# Altium project RFSOC_SAWG.PrjPCB (part 1 of 10)
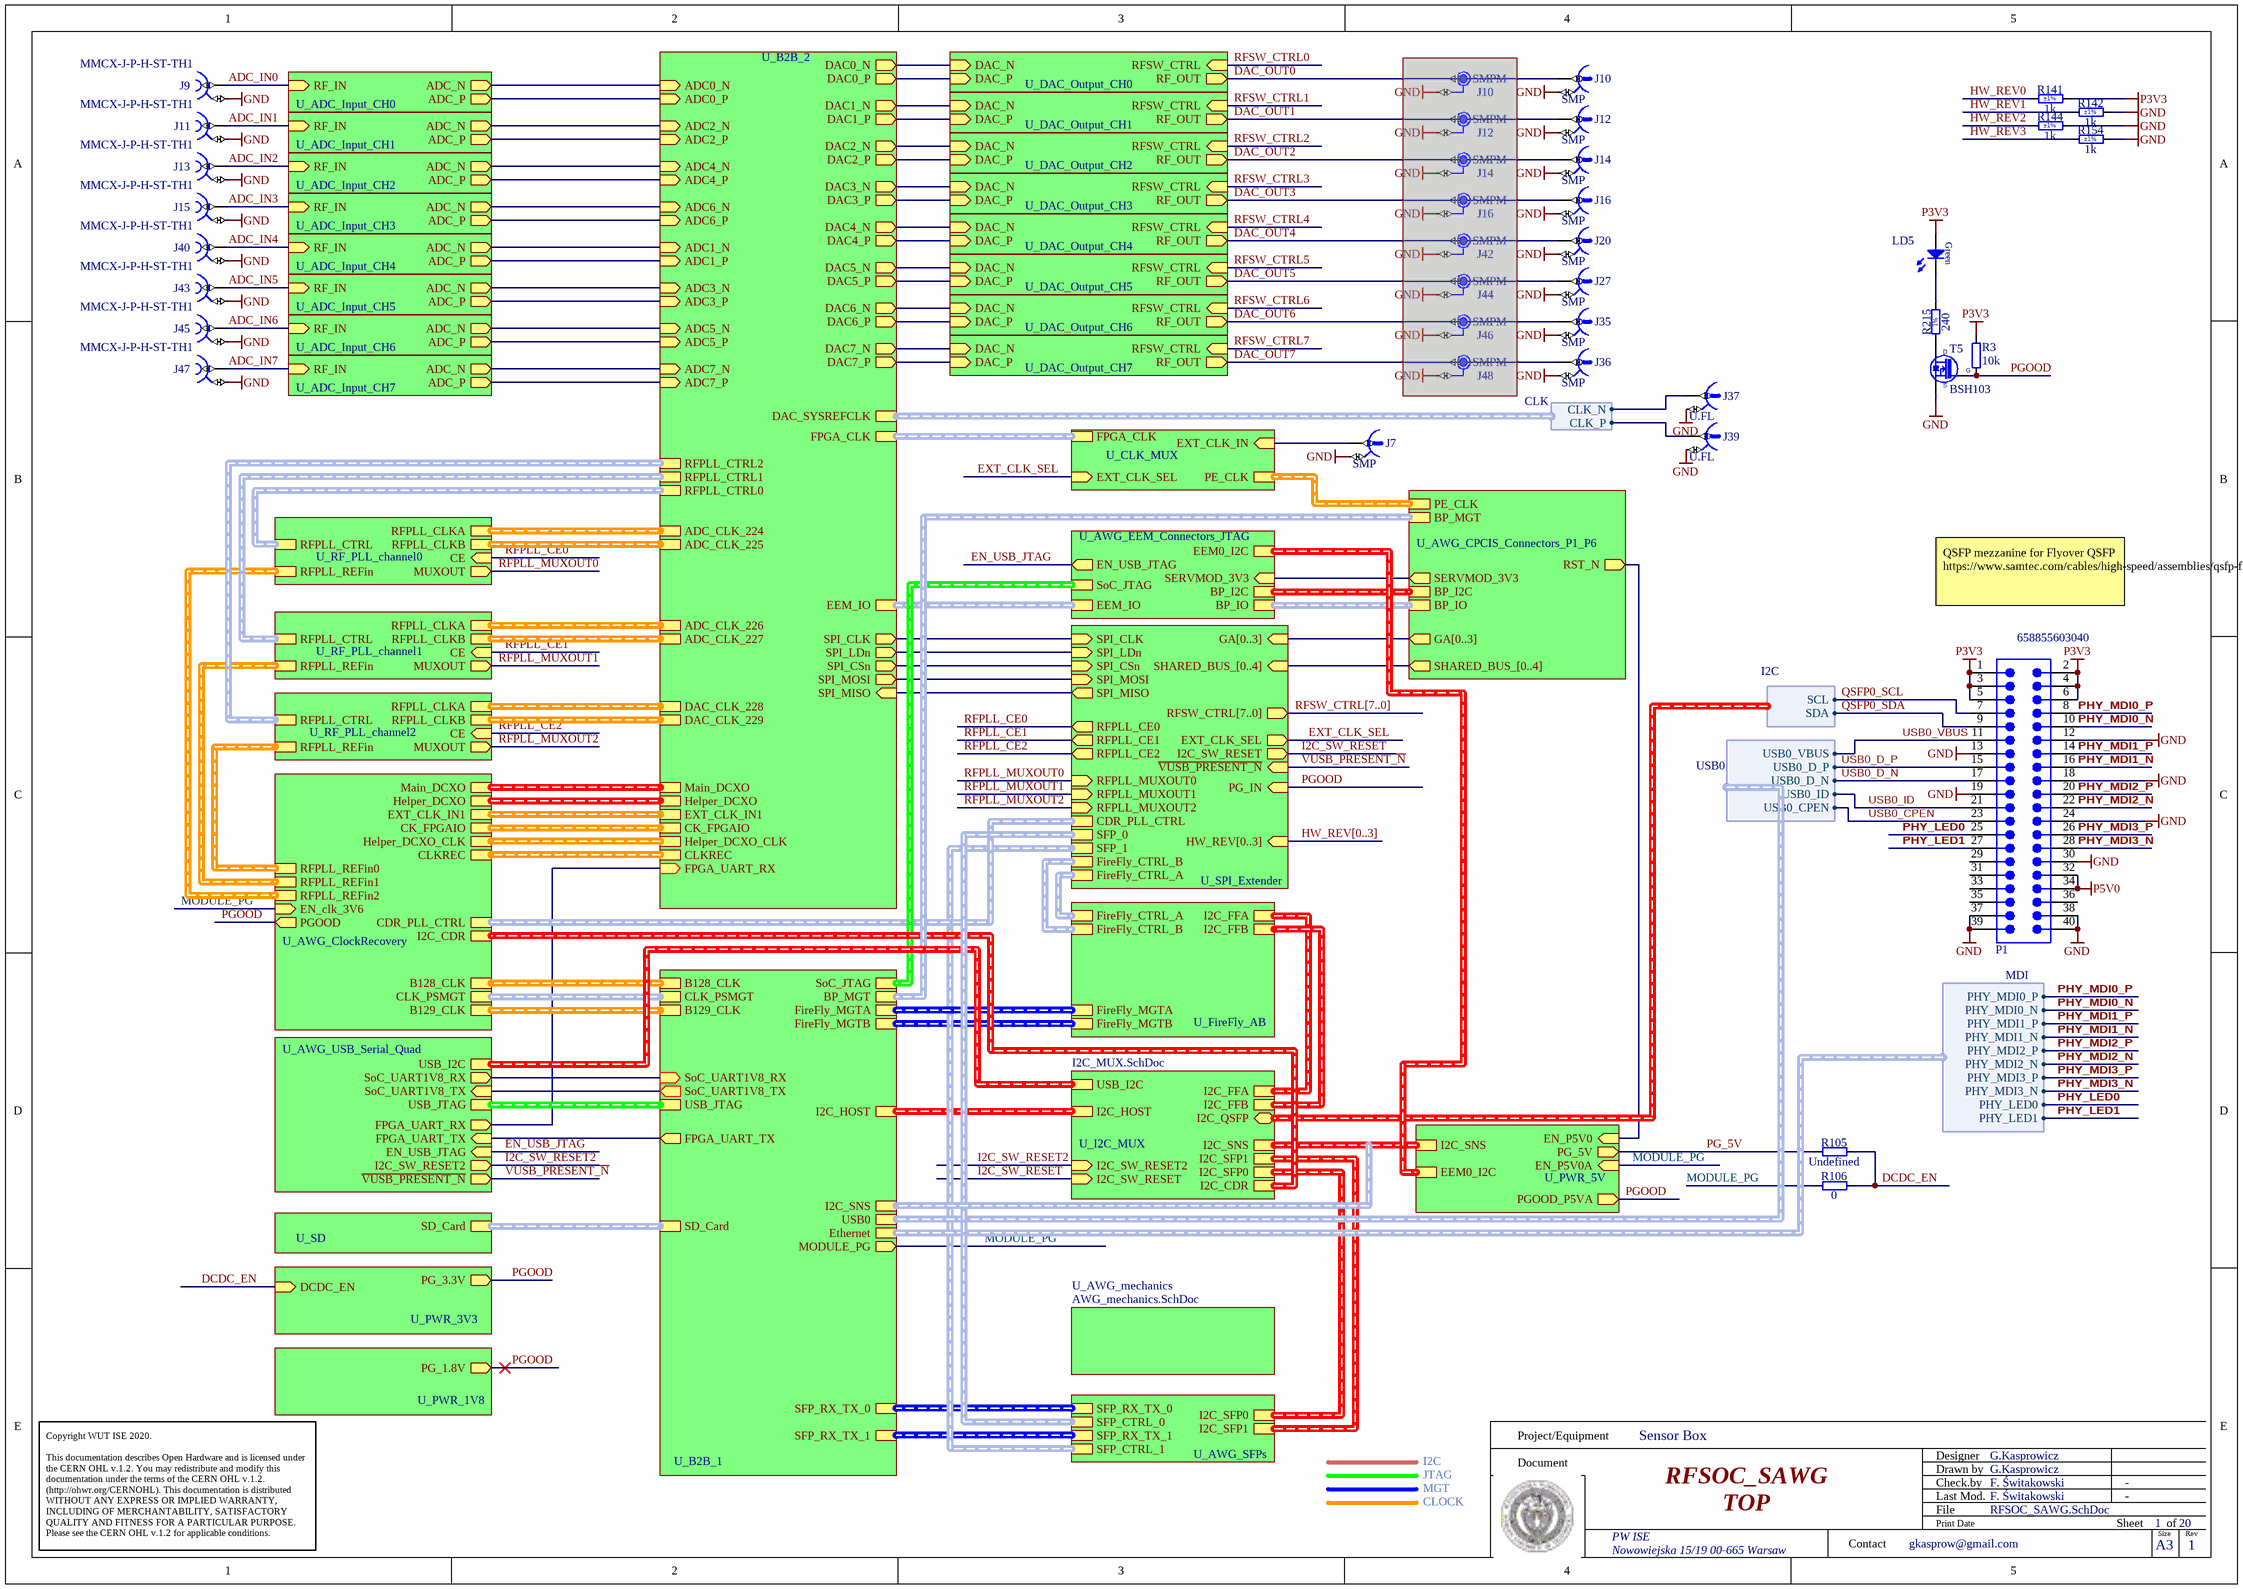
[diagram p0: RFSOC_SAWG.SchDoc]
Version: 2.0.1
20 sheets, 1119 parts. Net scope: hierarchical (ports join the sheet entries above them; power ports are global).
Board file: RFSOC_SAWG.PcbDoc
Sheets:
  RFSOC_SAWG.SchDoc
    U_CLK_MUX = AWG_CLK_Connectors.SchDoc
    U_FireFly_AB = FireFly_AB.SchDoc
    U_I2C_MUX = I2C_MUX.SchDoc
    U_SD = SD.SchDoc
    U_B2B_1 = B2B_1.SchDoc
    U_B2B_2 = B2B_2.SchDoc
    U_PWR_3V3 = PWR_3V3.SchDoc
    U_PWR_1V8 = PWR_1V8.SchDoc
    U_PWR_5V = PWR_5V.SchDoc
    U_AWG_CPCIS_Connectors_P1_P6 = AWG_CPCIS_Connectors_P1_P6.SchDoc
    U_AWG_EEM_Connectors_JTAG = AWG_EEM_Connectors_JTAG.SchDoc
    U_DAC_Output_CH0 = DAC_Output_CH.SchDoc
    U_DAC_Output_CH1 = DAC_Output_CH.SchDoc
    U_DAC_Output_CH2 = DAC_Output_CH.SchDoc
    U_DAC_Output_CH3 = DAC_Output_CH.SchDoc
    U_DAC_Output_CH4 = DAC_Output_CH.SchDoc
    U_DAC_Output_CH5 = DAC_Output_CH.SchDoc
    U_DAC_Output_CH6 = DAC_Output_CH.SchDoc
    U_DAC_Output_CH7 = DAC_Output_CH.SchDoc
    U_ADC_Input_CH0 = ADC_Input_CH.SchDoc
    U_ADC_Input_CH1 = ADC_Input_CH.SchDoc
    U_ADC_Input_CH2 = ADC_Input_CH.SchDoc
    U_ADC_Input_CH3 = ADC_Input_CH.SchDoc
    U_ADC_Input_CH4 = ADC_Input_CH.SchDoc
    U_ADC_Input_CH5 = ADC_Input_CH.SchDoc
    U_ADC_Input_CH6 = ADC_Input_CH.SchDoc
    U_ADC_Input_CH7 = ADC_Input_CH.SchDoc
    U_AWG_SFPs = AWG_SFPs.SchDoc
    U_AWG_ClockRecovery = AWG_ClockRecovery.SchDoc
    U_RF_PLL_channel2 = RF_PLL_channel.SchDoc
    U_RF_PLL_channel0 = RF_PLL_channel.SchDoc
    U_RF_PLL_channel1 = RF_PLL_channel.SchDoc
    U_SPI_Extender = SPI_Extender.SchDoc
    U_AWG_mechanics = AWG_mechanics.SchDoc
    U_AWG_USB_Serial_Quad = AWG_USB_Serial_Quad.SchDoc

## Sheet RFSOC_SAWG.SchDoc: RFSOC_SAWG
size 420 x 297 mm; CheckedBy: F. Świtakowski; Author: G.Kasprowicz; CompanyName: WUT ISE; DrawnBy: G.Kasprowicz; Organization: WUT ISE; Address1: PW ISE; Address2: Nowowiejska 15/19 00-665 Warsaw; Address3: gkasprow@gmail.com; DocumentNumber: 1; Revision: 1; SheetNumber: 1; SheetTotal: 20; ModifiedBy: F. Świtakowski; CheckedDate: -; Title2: TOP; DivGrp: WUT ISE; Designer: G.Kasprowicz; ModifiedDate: -; ProjectName: Sensor Box

### Parts
(Parts that share a designator on the sheet are numbered #1, #2 ... from top to bottom, then left to right.)
J7  SMP  [AMPHENOL_302102]
J9  Manufacturer Part Number: MMCX-J-P-H-ST-TH1  [SAMTEC_MMCX-J-P-H-ST-TH1]  (hidden comment: Coax_1Female_1Shield)
J10#1  SMPM  [SAMTEC_SMPM-PF-P-HG-ST-EM-1]  (masked out: inside a compile mask, not in the netlist)
J10#2  SMP  [AMPHENOL_302102]
J11  Manufacturer Part Number: MMCX-J-P-H-ST-TH1  [SAMTEC_MMCX-J-P-H-ST-TH1]  (hidden comment: Coax_1Female_1Shield)
J12#1  SMPM  [SAMTEC_SMPM-PF-P-HG-ST-EM-1]  (masked out: inside a compile mask, not in the netlist)
J12#2  SMP  [AMPHENOL_302102]
J13  Manufacturer Part Number: MMCX-J-P-H-ST-TH1  [SAMTEC_MMCX-J-P-H-ST-TH1]  (hidden comment: Coax_1Female_1Shield)
J14#1  SMPM  [SAMTEC_SMPM-PF-P-HG-ST-EM-1]  (masked out: inside a compile mask, not in the netlist)
J14#2  SMP  [AMPHENOL_302102]
J15  Manufacturer Part Number: MMCX-J-P-H-ST-TH1  [SAMTEC_MMCX-J-P-H-ST-TH1]  (hidden comment: Coax_1Female_1Shield)
J16#1  SMPM  [SAMTEC_SMPM-PF-P-HG-ST-EM-1]  (masked out: inside a compile mask, not in the netlist)
J16#2  SMP  [AMPHENOL_302102]
J20  SMP  [AMPHENOL_302102]
J27  SMP  [AMPHENOL_302102]
J35  SMP  [AMPHENOL_302102]
J36  SMP  [AMPHENOL_302102]
J37  U.FL  [HIROSE_U.FL-R-SMT-1(10)]
J39  U.FL  [HIROSE_U.FL-R-SMT-1(10)]
J40  Manufacturer Part Number: MMCX-J-P-H-ST-TH1  [SAMTEC_MMCX-J-P-H-ST-TH1]  (hidden comment: Coax_1Female_1Shield)
J42  SMPM  [SAMTEC_SMPM-PF-P-HG-ST-EM-1]  (masked out: inside a compile mask, not in the netlist)
J43  Manufacturer Part Number: MMCX-J-P-H-ST-TH1  [SAMTEC_MMCX-J-P-H-ST-TH1]  (hidden comment: Coax_1Female_1Shield)
J44  SMPM  [SAMTEC_SMPM-PF-P-HG-ST-EM-1]  (masked out: inside a compile mask, not in the netlist)
J45  Manufacturer Part Number: MMCX-J-P-H-ST-TH1  [SAMTEC_MMCX-J-P-H-ST-TH1]  (hidden comment: Coax_1Female_1Shield)
J46  SMPM  [SAMTEC_SMPM-PF-P-HG-ST-EM-1]  (masked out: inside a compile mask, not in the netlist)
J47  Manufacturer Part Number: MMCX-J-P-H-ST-TH1  [SAMTEC_MMCX-J-P-H-ST-TH1]  (hidden comment: Coax_1Female_1Shield)
J48  SMPM  [SAMTEC_SMPM-PF-P-HG-ST-EM-1]  (masked out: inside a compile mask, not in the netlist)
LD5  Green  [LED_AVAGO_HSME-C120]  (value not drawn)
P1  658855603040  [658855603040]
R3#1  10k  [RESC1005X40N]
R105  Undefined  [RESC1005X40N]
R106  0  [RESC1005X40N]
R141  1k  Tolerance: ±1%  [RESC1005X40N]
R142  1k  Tolerance: ±1%  [RESC1005X40N]
R144  1k  Tolerance: ±1%  [RESC1005X40N]
R154  1k  Tolerance: ±1%  [RESC1005X40N]
R215  240  [RESC1005X40N]
T5  BSH103  [SOT95P230X110-3N]

### Sub-sheets
U_ADC_Input_CH0 = ADC_Input_CH.SchDoc: ADC_N (out), ADC_P (out), RF_IN (in)
U_ADC_Input_CH1 = ADC_Input_CH.SchDoc: ADC_N (out), ADC_P (out), RF_IN (in)
U_ADC_Input_CH2 = ADC_Input_CH.SchDoc: ADC_N (out), ADC_P (out), RF_IN (in)
U_ADC_Input_CH3 = ADC_Input_CH.SchDoc: ADC_N (out), ADC_P (out), RF_IN (in)
U_ADC_Input_CH4 = ADC_Input_CH.SchDoc: ADC_N (out), ADC_P (out), RF_IN (in)
U_ADC_Input_CH5 = ADC_Input_CH.SchDoc: ADC_N (out), ADC_P (out), RF_IN (in)
U_ADC_Input_CH6 = ADC_Input_CH.SchDoc: ADC_N (out), ADC_P (out), RF_IN (in)
U_ADC_Input_CH7 = ADC_Input_CH.SchDoc: ADC_N (out), ADC_P (out), RF_IN (in)
U_AWG_ClockRecovery = AWG_ClockRecovery.SchDoc: CDR_PLL_CTRL (harness CDR_PLL_CTRL), I2C_CDR (harness I2C), RFPLL_REFin1 (harness CLK), RFPLL_REFin0 (harness CLK), CLK_PSMGT (harness CLK), CK_FPGAIO (harness CLK), Helper_DCXO_CLK (harness CLK), CLKREC (harness CLK), B129_CLK (harness CLK), B128_CLK (harness CLK), RFPLL_REFin2 (harness CLK), EXT_CLK_IN1 (harness CLK), Main_DCXO (harness I2C), Helper_DCXO (harness I2C), EN_clk_3V6 (in), PGOOD (out)
U_AWG_CPCIS_Connectors_P1_P6 = AWG_CPCIS_Connectors_P1_P6.SchDoc: BP_MGT (harness MGT), PE_CLK (harness CLK_DIFF), RST_N (out), SERVMOD_3V3 (out), BP_I2C (harness I2C), BP_IO (harness EEM_LVDS), SHARED_BUS_[0..4] (out), GA[0..3] (out)
U_AWG_EEM_Connectors_JTAG = AWG_EEM_Connectors_JTAG.SchDoc: SoC_JTAG (harness JTAG5), BP_I2C (harness I2C), EEM_IO (harness EEM_LVDS), BP_IO (harness EEM_LVDS), SERVMOD_3V3 (in), EEM0_I2C (harness I2C), EN_USB_JTAG (out)
U_AWG_mechanics = AWG_mechanics.SchDoc: no entries
U_AWG_SFPs = AWG_SFPs.SchDoc: SFP_RX_TX_0 (harness SFP_RX_TX), SFP_CTRL_0 (harness SFP), SFP_RX_TX_1 (harness SFP_RX_TX), SFP_CTRL_1 (harness SFP), I2C_SFP0 (harness I2C), I2C_SFP1 (harness I2C)
U_AWG_USB_Serial_Quad = AWG_USB_Serial_Quad.SchDoc: EN_USB_JTAG (in), ~{VUSB_PRESENT_N} (out), I2C_SW_RESET2 (out), USB_JTAG (harness JTAG), USB_I2C (harness I2C), FPGA_UART_RX (out), FPGA_UART_TX (in), SoC_UART1V8_RX (out), SoC_UART1V8_TX (in)
U_B2B_1 = B2B_1.SchDoc: FireFly_MGTA (harness FireFly_MGT), FireFly_MGTB (harness FireFly_MGT), SD_Card (harness SD_CARD), I2C_HOST (harness I2C_INT), SoC_UART1V8_RX (in), SoC_UART1V8_TX (out), USB_JTAG (harness JTAG), USB0 (harness USB0), Ethernet (harness MDI), B128_CLK (harness CLK), B129_CLK (harness CLK), MODULE_PG (out), SFP_RX_TX_0 (harness SFP_RX_TX), SFP_RX_TX_1 (harness SFP_RX_TX), CLK_PSMGT (harness CLK), BP_MGT (harness MGT), SoC_JTAG (harness JTAG5), FPGA_UART_TX (out), I2C_SNS
U_B2B_2 = B2B_2.SchDoc: DAC0_N (out), DAC0_P (out), DAC2_N (out), DAC2_P (out), DAC3_N (out), DAC3_P (out), DAC1_N (out), DAC1_P (out), DAC4_N (out), DAC4_P (out), DAC5_N (out), DAC5_P (out), DAC6_N (out), DAC6_P (out), DAC7_N (out), DAC7_P (out), EEM_IO (harness EEM_LVDS), ADC0_N (in), ADC0_P (in), ADC4_N (in), ADC4_P (in), ADC2_N (in), ADC2_P (in), ADC6_N (in), ADC6_P (in), ADC1_N (in), ADC1_P (in), ADC3_N (in), ADC3_P (in), ADC5_N (in), ADC5_P (in), ADC7_N (in), ADC7_P (in), RFPLL_CTRL1 (harness RFPLL_CTRL), RFPLL_CTRL2 (harness RFPLL_CTRL), RFPLL_CTRL0 (harness RFPLL_CTRL), DAC_SYSREFCLK (harness CLK), ADC_CLK_224 (harness CLK), ADC_CLK_225 (harness CLK), ADC_CLK_226 (harness CLK), ADC_CLK_227 (harness CLK), DAC_CLK_229 (harness CLK), DAC_CLK_228 (harness CLK), SPI_CLK (out), SPI_LDn (out), SPI_CSn (out), SPI_MOSI (out), SPI_MISO (in), FPGA_CLK (harness CLK), FPGA_UART_RX (in), Helper_DCXO_CLK (harness CLK), CK_FPGAIO (harness CLK), EXT_CLK_IN1 (harness CLK), Main_DCXO (harness I2C), Helper_DCXO (harness I2C), CLKREC (harness CLK)
U_CLK_MUX = AWG_CLK_Connectors.SchDoc: EXT_CLK_IN (in), PE_CLK (harness CLK), FPGA_CLK (harness CLK), EXT_CLK_SEL (in)
U_DAC_Output_CH0 = DAC_Output_CH.SchDoc: DAC_N (in), DAC_P (in), RFSW_CTRL (in), RF_OUT (out)
U_DAC_Output_CH1 = DAC_Output_CH.SchDoc: DAC_N (in), DAC_P (in), RFSW_CTRL (in), RF_OUT (out)
U_DAC_Output_CH2 = DAC_Output_CH.SchDoc: DAC_N (in), DAC_P (in), RFSW_CTRL (in), RF_OUT (out)
U_DAC_Output_CH3 = DAC_Output_CH.SchDoc: DAC_N (in), DAC_P (in), RFSW_CTRL (in), RF_OUT (out)
U_DAC_Output_CH4 = DAC_Output_CH.SchDoc: DAC_N (in), DAC_P (in), RFSW_CTRL (in), RF_OUT (out)
U_DAC_Output_CH5 = DAC_Output_CH.SchDoc: DAC_N (in), DAC_P (in), RFSW_CTRL (in), RF_OUT (out)
U_DAC_Output_CH6 = DAC_Output_CH.SchDoc: DAC_N (in), DAC_P (in), RFSW_CTRL (in), RF_OUT (out)
U_DAC_Output_CH7 = DAC_Output_CH.SchDoc: DAC_N (in), DAC_P (in), RFSW_CTRL (in), RF_OUT (out)
U_FireFly_AB = FireFly_AB.SchDoc: I2C_FFB (harness I2C), I2C_FFA (harness I2C), FireFly_MGTA (harness FireFly_MGT), FireFly_MGTB (harness FireFly_MGT), FireFly_CTRL_A (harness FireFLy_CTRL), FireFly_CTRL_B (harness FireFLy_CTRL)
U_I2C_MUX = I2C_MUX.SchDoc: I2C_FFB (harness I2C), I2C_FFA (harness I2C), I2C_HOST (harness I2C_INT), I2C_SNS (harness I2C), I2C_CDR (harness I2C), I2C_SFP0 (harness I2C), I2C_SFP1 (harness I2C), I2C_QSFP (bidir, harness I2C), I2C_SW_RESET2 (in), USB_I2C (harness I2C), I2C_SW_RESET (in)
U_PWR_1V8 = PWR_1V8.SchDoc: PG_1.8V (out)
U_PWR_3V3 = PWR_3V3.SchDoc: DCDC_EN (in), PG_3.3V (out)
U_PWR_5V = PWR_5V.SchDoc: I2C_SNS (harness I2C), PG_5V (out), EEM0_I2C (harness I2C), EN_P5V0 (in), EN_P5V0A (in), PGOOD_P5VA (out)
U_RF_PLL_channel0 = RF_PLL_channel.SchDoc: RFPLL_CLKA (harness CLK), RFPLL_CLKB (harness CLK), RFPLL_REFin (harness CLK), RFPLL_CTRL (harness RFPLL_CTRL), CE (in), MUXOUT (out)
U_RF_PLL_channel1 = RF_PLL_channel.SchDoc: RFPLL_CLKA (harness CLK), RFPLL_CLKB (harness CLK), RFPLL_REFin (harness CLK), RFPLL_CTRL (harness RFPLL_CTRL), CE (in), MUXOUT (out)
U_RF_PLL_channel2 = RF_PLL_channel.SchDoc: RFPLL_CLKA (harness CLK), RFPLL_CLKB (harness CLK), RFPLL_REFin (harness CLK), RFPLL_CTRL (harness RFPLL_CTRL), CE (in), MUXOUT (out)
U_SD = SD.SchDoc: SD_Card (harness SD_CARD)
U_SPI_Extender = SPI_Extender.SchDoc: FireFly_CTRL_A (harness FireFLy_CTRL), FireFly_CTRL_B (harness FireFLy_CTRL), PG_IN (in), SHARED_BUS_[0..4] (in), GA[0..3] (in), CDR_PLL_CTRL (harness CDR_PLL_CTRL), SFP_0 (harness SFP), SFP_1 (harness SFP), RFSW_CTRL[7..0] (out), RFPLL_CE0 (out), RFPLL_CE1 (out), RFPLL_CE2 (out), RFPLL_MUXOUT0 (in), RFPLL_MUXOUT1 (in), RFPLL_MUXOUT2 (in), SPI_CLK (in), SPI_LDn (in), SPI_CSn (in), SPI_MOSI (in), SPI_MISO (out), ~{VUSB_PRESENT_N} (in), I2C_SW_RESET (out), EXT_CLK_SEL (out), HW_REV[0..3] (in)

### Harnesses
I2C: SDA, SCL
CLK: CLK_N, CLK_P
USB0: USB0_VBUS, USB0_D_P, USB0_D_N, USB0_ID, USB0_CPEN
MDI: PHY_MDI0_N, PHY_MDI1_P, PHY_MDI1_N, PHY_MDI2_P, PHY_MDI2_N, PHY_MDI3_P, PHY_MDI3_N, PHY_LED0, PHY_LED1, PHY_MDI0_P

### Nets
GND: J7.2 J9.2 J10#2.2 J11.2 J12#2.2 J13.2 J14#2.2 J15.2 J16#2.2 J20.2 J27.2 J35.2 J36.2 J37.2 J39.2 J40.2 J43.2 J45.2 J47.2 P1.12 P1.13 P1.18 P1.19 P1.24 P1.30 P1.37 P1.38 P1.39 P1.40 R142.2 R144.2 R154.2 T5.2(S)
P3V3: LD5.2(A) P1.1 P1.2 P1.3 P1.4 P1.5 P1.6 R3#1.1 R141.2
P5V0: P1.32 P1.34
~{VUSB_PRESENT_N}: sheet U_SPI_Extender/~{VUSB_PRESENT_N}, sheet U_AWG_USB_Serial_Quad/~{VUSB_PRESENT_N}
ADC0_N: sheet U_B2B_2/ADC0_N, sheet U_ADC_Input_CH0/ADC_N
ADC0_N: sheet U_B2B_2/ADC1_N, sheet U_ADC_Input_CH4/ADC_N  [a separate net that carries the same name]
ADC0_N: sheet U_B2B_2/ADC2_N, sheet U_ADC_Input_CH1/ADC_N  [a separate net that carries the same name]
ADC0_N: sheet U_B2B_2/ADC3_N, sheet U_ADC_Input_CH5/ADC_N  [a separate net that carries the same name]
ADC0_N: sheet U_B2B_2/ADC4_N, sheet U_ADC_Input_CH2/ADC_N  [a separate net that carries the same name]
ADC0_N: sheet U_B2B_2/ADC5_N, sheet U_ADC_Input_CH6/ADC_N  [a separate net that carries the same name]
ADC0_N: sheet U_B2B_2/ADC6_N, sheet U_ADC_Input_CH3/ADC_N  [a separate net that carries the same name]
ADC0_N: sheet U_B2B_2/ADC7_N, sheet U_ADC_Input_CH7/ADC_N  [a separate net that carries the same name]
ADC0_P: sheet U_B2B_2/ADC0_P, sheet U_ADC_Input_CH0/ADC_P
ADC0_P: sheet U_B2B_2/ADC1_P, sheet U_ADC_Input_CH4/ADC_P  [a separate net that carries the same name]
ADC0_P: sheet U_B2B_2/ADC2_P, sheet U_ADC_Input_CH1/ADC_P  [a separate net that carries the same name]
ADC0_P: sheet U_B2B_2/ADC3_P, sheet U_ADC_Input_CH5/ADC_P  [a separate net that carries the same name]
ADC0_P: sheet U_B2B_2/ADC4_P, sheet U_ADC_Input_CH2/ADC_P  [a separate net that carries the same name]
ADC0_P: sheet U_B2B_2/ADC5_P, sheet U_ADC_Input_CH6/ADC_P  [a separate net that carries the same name]
ADC0_P: sheet U_B2B_2/ADC6_P, sheet U_ADC_Input_CH3/ADC_P  [a separate net that carries the same name]
ADC0_P: sheet U_B2B_2/ADC7_P, sheet U_ADC_Input_CH7/ADC_P  [a separate net that carries the same name]
ADC_IN0: J9.1 ; sheet U_ADC_Input_CH0/RF_IN  [project net ADC0_IN]
ADC_IN1: J11.1 ; sheet U_ADC_Input_CH1/RF_IN  [project net ADC0_IN]
ADC_IN2: J13.1 ; sheet U_ADC_Input_CH2/RF_IN  [project net ADC0_IN]
ADC_IN3: J15.1 ; sheet U_ADC_Input_CH3/RF_IN  [project net ADC0_IN]
ADC_IN4: J40.1 ; sheet U_ADC_Input_CH4/RF_IN  [project net ADC0_IN]
ADC_IN5: J43.1 ; sheet U_ADC_Input_CH5/RF_IN  [project net ADC0_IN]
ADC_IN6: J45.1 ; sheet U_ADC_Input_CH6/RF_IN  [project net ADC0_IN]
ADC_IN7: J47.1 ; sheet U_ADC_Input_CH7/RF_IN  [project net ADC0_IN]
CPLD_IO2: sheet U_B2B_1/FPGA_UART_TX, sheet U_AWG_USB_Serial_Quad/FPGA_UART_TX
DAC0_N: sheet U_B2B_2/DAC7_N, sheet U_DAC_Output_CH7/DAC_N
DAC0_N: sheet U_B2B_2/DAC6_N, sheet U_DAC_Output_CH6/DAC_N  [a separate net that carries the same name]
DAC0_N: sheet U_B2B_2/DAC5_N, sheet U_DAC_Output_CH5/DAC_N  [a separate net that carries the same name]
DAC0_N: sheet U_B2B_2/DAC4_N, sheet U_DAC_Output_CH4/DAC_N  [a separate net that carries the same name]
DAC0_N: sheet U_B2B_2/DAC3_N, sheet U_DAC_Output_CH3/DAC_N  [a separate net that carries the same name]
DAC0_N: sheet U_B2B_2/DAC2_N, sheet U_DAC_Output_CH2/DAC_N  [a separate net that carries the same name]
DAC0_N: sheet U_B2B_2/DAC1_N, sheet U_DAC_Output_CH1/DAC_N  [a separate net that carries the same name]
DAC0_N: sheet U_B2B_2/DAC0_N, sheet U_DAC_Output_CH0/DAC_N  [a separate net that carries the same name]
DAC0_P: sheet U_B2B_2/DAC7_P, sheet U_DAC_Output_CH7/DAC_P
DAC0_P: sheet U_B2B_2/DAC6_P, sheet U_DAC_Output_CH6/DAC_P  [a separate net that carries the same name]
DAC0_P: sheet U_B2B_2/DAC5_P, sheet U_DAC_Output_CH5/DAC_P  [a separate net that carries the same name]
DAC0_P: sheet U_B2B_2/DAC4_P, sheet U_DAC_Output_CH4/DAC_P  [a separate net that carries the same name]
DAC0_P: sheet U_B2B_2/DAC3_P, sheet U_DAC_Output_CH3/DAC_P  [a separate net that carries the same name]
DAC0_P: sheet U_B2B_2/DAC2_P, sheet U_DAC_Output_CH2/DAC_P  [a separate net that carries the same name]
DAC0_P: sheet U_B2B_2/DAC1_P, sheet U_DAC_Output_CH1/DAC_P  [a separate net that carries the same name]
DAC0_P: sheet U_B2B_2/DAC0_P, sheet U_DAC_Output_CH0/DAC_P  [a separate net that carries the same name]
DAC_OUT0: J10#2.1 ; sheet U_DAC_Output_CH0/RF_OUT
DAC_OUT1: J12#2.1 ; sheet U_DAC_Output_CH1/RF_OUT
DAC_OUT2: J14#2.1 ; sheet U_DAC_Output_CH2/RF_OUT
DAC_OUT3: J16#2.1 ; sheet U_DAC_Output_CH3/RF_OUT
DAC_OUT4: J20.1 ; sheet U_DAC_Output_CH4/RF_OUT
DAC_OUT5: J27.1 ; sheet U_DAC_Output_CH5/RF_OUT
DAC_OUT6: J35.1 ; sheet U_DAC_Output_CH6/RF_OUT
DAC_OUT7: J36.1 ; sheet U_DAC_Output_CH7/RF_OUT
DAC_SYSREFCLK_N: J37.1 ; sheet U_B2B_2/DAC_SYSREFCLK.CLK_N
DAC_SYSREFCLK_P: J39.1 ; sheet U_B2B_2/DAC_SYSREFCLK.CLK_P
DCDC_EN: R105.2 R106.2 ; sheet U_PWR_3V3/DCDC_EN
EN_USB_JTAG: sheet U_AWG_EEM_Connectors_JTAG/EN_USB_JTAG, sheet U_AWG_USB_Serial_Quad/EN_USB_JTAG
EXT_CLK_SEL: sheet U_CLK_MUX/EXT_CLK_SEL, sheet U_SPI_Extender/EXT_CLK_SEL
FPGA_UART_RX: sheet U_B2B_2/FPGA_UART_RX, sheet U_AWG_USB_Serial_Quad/FPGA_UART_RX
HW_REV0: R141.1
HW_REV1: R142.1
HW_REV2: R144.1
HW_REV3: R154.1
I2C_SW_RESET: sheet U_I2C_MUX/I2C_SW_RESET, sheet U_SPI_Extender/I2C_SW_RESET
I2C_SW_RESET2: sheet U_I2C_MUX/I2C_SW_RESET2, sheet U_AWG_USB_Serial_Quad/I2C_SW_RESET2
MODULE_PG: R106.1 ; sheet U_B2B_1/MODULE_PG, sheet U_PWR_5V/EN_P5V0A, sheet U_AWG_ClockRecovery/EN_clk_3V6  [project net EN_clk_3V6]
PG_5V: R105.1 ; sheet U_PWR_5V/PG_5V
PGOOD: R3#1.2 T5.1(G) ; sheet U_PWR_3V3/PG_3.3V, sheet U_PWR_1V8/PG_1.8V, sheet U_PWR_5V/PGOOD_P5VA, sheet U_AWG_ClockRecovery/PGOOD, sheet U_SPI_Extender/PG_IN  [project net PG_1.8V]
PHY_LED0: P1.25 ; sheet U_B2B_1/Ethernet.PHY_LED0
PHY_LED1: P1.27 ; sheet U_B2B_1/Ethernet.PHY_LED1
PHY_MDI0_N: P1.10 ; sheet U_B2B_1/Ethernet.PHY_MDI0_N
PHY_MDI0_P: P1.8 ; sheet U_B2B_1/Ethernet.PHY_MDI0_P
PHY_MDI1_N: P1.16 ; sheet U_B2B_1/Ethernet.PHY_MDI1_N
PHY_MDI1_P: P1.14 ; sheet U_B2B_1/Ethernet.PHY_MDI1_P
PHY_MDI2_N: P1.22 ; sheet U_B2B_1/Ethernet.PHY_MDI2_N
PHY_MDI2_P: P1.20 ; sheet U_B2B_1/Ethernet.PHY_MDI2_P
PHY_MDI3_N: P1.28 ; sheet U_B2B_1/Ethernet.PHY_MDI3_N
PHY_MDI3_P: P1.26 ; sheet U_B2B_1/Ethernet.PHY_MDI3_P
QSFP0_SCL: P1.7 ; sheet U_I2C_MUX/I2C_QSFP.SCL
QSFP0_SDA: P1.9 ; sheet U_I2C_MUX/I2C_QSFP.SDA
RFPLL_CE0: sheet U_RF_PLL_channel0/CE, sheet U_SPI_Extender/RFPLL_CE0  [project net CE]
RFPLL_CE1: sheet U_RF_PLL_channel1/CE, sheet U_SPI_Extender/RFPLL_CE1  [project net CE]
RFPLL_CE2: sheet U_RF_PLL_channel2/CE, sheet U_SPI_Extender/RFPLL_CE2  [project net CE]
RFPLL_MUXOUT0: sheet U_RF_PLL_channel0/MUXOUT, sheet U_SPI_Extender/RFPLL_MUXOUT0  [project net MUXOUT]
RFPLL_MUXOUT1: sheet U_RF_PLL_channel1/MUXOUT, sheet U_SPI_Extender/RFPLL_MUXOUT1  [project net MUXOUT]
RFPLL_MUXOUT2: sheet U_RF_PLL_channel2/MUXOUT, sheet U_SPI_Extender/RFPLL_MUXOUT2  [project net MUXOUT]
RST_N: sheet U_PWR_5V/EN_P5V0, sheet U_AWG_CPCIS_Connectors_P1_P6/RST_N
SERVMOD_3V3: sheet U_AWG_CPCIS_Connectors_P1_P6/SERVMOD_3V3, sheet U_AWG_EEM_Connectors_JTAG/SERVMOD_3V3
SPI_CLK: sheet U_B2B_2/SPI_CLK, sheet U_SPI_Extender/SPI_CLK
SPI_CSn: sheet U_B2B_2/SPI_CSn, sheet U_SPI_Extender/SPI_CSn
SPI_LDn: sheet U_B2B_2/SPI_LDn, sheet U_SPI_Extender/SPI_LDn
SPI_MISO: sheet U_B2B_2/SPI_MISO, sheet U_SPI_Extender/SPI_MISO
SPI_MOSI: sheet U_B2B_2/SPI_MOSI, sheet U_SPI_Extender/SPI_MOSI
UART0_RX: sheet U_B2B_1/SoC_UART1V8_RX, sheet U_AWG_USB_Serial_Quad/SoC_UART1V8_RX
UART0_TX: sheet U_B2B_1/SoC_UART1V8_TX, sheet U_AWG_USB_Serial_Quad/SoC_UART1V8_TX
USB0_CPEN: P1.23 ; sheet U_B2B_1/USB0.USB0_CPEN
USB0_D_N: P1.17 ; sheet U_B2B_1/USB0.USB0_D_N
USB0_D_P: P1.15 ; sheet U_B2B_1/USB0.USB0_D_P
USB0_ID: P1.21 ; sheet U_B2B_1/USB0.USB0_ID
USB0_VBUS: P1.11 ; sheet U_B2B_1/USB0.USB0_VBUS
NetJ7_1: J7.1 ; sheet U_CLK_MUX/EXT_CLK_IN
NetLD5_1: LD5.1(C) R215.2
NetR215_1: R215.1 T5.3(D)

Not connected (* = marked no-connect by the designer): P1 29 31 33 35 36

### Buses and harness runs
bus HW_REV[0..3] = sheet U_SPI_Extender/HW_REV[0..3]
bus RFSW_CTRL[7..0] = sheet U_SPI_Extender/RFSW_CTRL[7..0]
bus sheet U_AWG_CPCIS_Connectors_P1_P6/GA[0..3] = sheet U_SPI_Extender/GA[0..3]
bus sheet U_AWG_CPCIS_Connectors_P1_P6/SHARED_BUS_[0..4] = sheet U_SPI_Extender/SHARED_BUS_[0..4]
harness sheet U_AWG_ClockRecovery/B128_CLK = sheet U_B2B_1/B128_CLK
harness sheet U_AWG_ClockRecovery/B129_CLK = sheet U_B2B_1/B129_CLK
harness sheet U_AWG_ClockRecovery/CDR_PLL_CTRL = sheet U_SPI_Extender/CDR_PLL_CTRL
harness sheet U_AWG_ClockRecovery/CK_FPGAIO = sheet U_B2B_2/CK_FPGAIO
harness sheet U_AWG_ClockRecovery/CLK_PSMGT = sheet U_B2B_1/CLK_PSMGT
harness sheet U_AWG_ClockRecovery/CLKREC = sheet U_B2B_2/CLKREC
harness sheet U_AWG_ClockRecovery/EXT_CLK_IN1 = sheet U_B2B_2/EXT_CLK_IN1
harness sheet U_AWG_ClockRecovery/Helper_DCXO = sheet U_B2B_2/Helper_DCXO
harness sheet U_AWG_ClockRecovery/Helper_DCXO_CLK = sheet U_B2B_2/Helper_DCXO_CLK
harness sheet U_AWG_ClockRecovery/I2C_CDR = sheet U_I2C_MUX/I2C_CDR
harness sheet U_AWG_ClockRecovery/Main_DCXO = sheet U_B2B_2/Main_DCXO
harness sheet U_AWG_ClockRecovery/RFPLL_REFin0 = sheet U_RF_PLL_channel2/RFPLL_REFin
harness sheet U_AWG_ClockRecovery/RFPLL_REFin1 = sheet U_RF_PLL_channel1/RFPLL_REFin
harness sheet U_AWG_ClockRecovery/RFPLL_REFin2 = sheet U_RF_PLL_channel0/RFPLL_REFin
harness sheet U_AWG_CPCIS_Connectors_P1_P6/BP_I2C = sheet U_AWG_EEM_Connectors_JTAG/BP_I2C
harness sheet U_AWG_CPCIS_Connectors_P1_P6/BP_IO = sheet U_AWG_EEM_Connectors_JTAG/BP_IO
harness sheet U_AWG_CPCIS_Connectors_P1_P6/BP_MGT = sheet U_B2B_1/BP_MGT
harness sheet U_AWG_CPCIS_Connectors_P1_P6/PE_CLK = sheet U_CLK_MUX/PE_CLK
harness sheet U_AWG_EEM_Connectors_JTAG/EEM0_I2C = sheet U_PWR_5V/EEM0_I2C
harness sheet U_AWG_EEM_Connectors_JTAG/EEM_IO = sheet U_B2B_2/EEM_IO
harness sheet U_AWG_EEM_Connectors_JTAG/SoC_JTAG = sheet U_B2B_1/SoC_JTAG
harness sheet U_AWG_SFPs/I2C_SFP0 = sheet U_I2C_MUX/I2C_SFP0
harness sheet U_AWG_SFPs/I2C_SFP1 = sheet U_I2C_MUX/I2C_SFP1
harness sheet U_AWG_SFPs/SFP_CTRL_0 = sheet U_SPI_Extender/SFP_0
harness sheet U_AWG_SFPs/SFP_CTRL_1 = sheet U_SPI_Extender/SFP_1
harness sheet U_AWG_SFPs/SFP_RX_TX_0 = sheet U_B2B_1/SFP_RX_TX_0
harness sheet U_AWG_SFPs/SFP_RX_TX_1 = sheet U_B2B_1/SFP_RX_TX_1
harness sheet U_AWG_USB_Serial_Quad/USB_I2C = sheet U_I2C_MUX/USB_I2C
harness sheet U_AWG_USB_Serial_Quad/USB_JTAG = sheet U_B2B_1/USB_JTAG
harness sheet U_B2B_1/FireFly_MGTA = sheet U_FireFly_AB/FireFly_MGTA
harness sheet U_B2B_1/FireFly_MGTB = sheet U_FireFly_AB/FireFly_MGTB
harness sheet U_B2B_1/I2C_HOST = sheet U_I2C_MUX/I2C_HOST
harness sheet U_B2B_1/I2C_SNS = sheet U_I2C_MUX/I2C_SNS = sheet U_PWR_5V/I2C_SNS
harness sheet U_B2B_1/SD_Card = sheet U_SD/SD_Card
harness sheet U_B2B_2/ADC_CLK_224 = sheet U_RF_PLL_channel0/RFPLL_CLKA
harness sheet U_B2B_2/ADC_CLK_225 = sheet U_RF_PLL_channel0/RFPLL_CLKB
harness sheet U_B2B_2/ADC_CLK_226 = sheet U_RF_PLL_channel1/RFPLL_CLKA
harness sheet U_B2B_2/ADC_CLK_227 = sheet U_RF_PLL_channel1/RFPLL_CLKB
harness sheet U_B2B_2/DAC_CLK_228 = sheet U_RF_PLL_channel2/RFPLL_CLKA
harness sheet U_B2B_2/DAC_CLK_229 = sheet U_RF_PLL_channel2/RFPLL_CLKB
harness sheet U_B2B_2/FPGA_CLK = sheet U_CLK_MUX/FPGA_CLK
harness sheet U_B2B_2/RFPLL_CTRL0 = sheet U_RF_PLL_channel0/RFPLL_CTRL
harness sheet U_B2B_2/RFPLL_CTRL1 = sheet U_RF_PLL_channel1/RFPLL_CTRL
harness sheet U_B2B_2/RFPLL_CTRL2 = sheet U_RF_PLL_channel2/RFPLL_CTRL
harness sheet U_FireFly_AB/FireFly_CTRL_A = sheet U_SPI_Extender/FireFly_CTRL_A
harness sheet U_FireFly_AB/FireFly_CTRL_B = sheet U_SPI_Extender/FireFly_CTRL_B
harness sheet U_FireFly_AB/I2C_FFA = sheet U_I2C_MUX/I2C_FFA
harness sheet U_FireFly_AB/I2C_FFB = sheet U_I2C_MUX/I2C_FFB

### Notes on the sheet
- QSFP mezzanine for Flyover QSFP
  https://www.samtec.com/cables/high-speed/assemblies/qsfp-flyover
- I2C
- JTAG
- MGT
- CLOCK
- Project/Equipment
- Document
- Designer
- Drawn by
- Check.by
- Copyright WUT ISE 2020.
  This documentation describes Open Hardware and is licensed under the CERN OHL v.1.2. You may redistribute and modify this documentation under the terms of the CERN OHL v.1.2. (http://ohwr.org/CERNOHL). This documentation is distributed WITHOUT ANY EXPRESS OR IMPLIED WARRANTY, INCLUDING OF MERCHANTABILITY, SATISFACTORY QUALITY AND FITNESS FOR A PARTICULAR PURPOSE. Please see the CERN OHL v.1.2 for applicable conditions.
- Contact
- File
- Last Mod.
- Print Date
- Sheet
- Size
- A3
- of
- Rev
- (in symbol R0402_240R_1%_0.0625W_100PPM) 1%

### Library data of the parts
J7 J10#2 J12#2 J14#2 J16#2 J20 J27 J35 J36 = AMPHENOL_302102: Part Description: 50 Ohm RF Connector, SMP End Launch Jack for 1.6mm PCB,  Flat Tab Contact; Manufacturer Part Number: 302102; PressFit: No; Part Number: AMPHENOL_302102; Component Kind: Standard; Component Type: Standard; Pin Count: 2; Family: SMP; Mounted: Yes; Socket: No; SMD: No; Sense: No; Status: None; Manufacturer: AMPHENOL; ComponentHeight: 5.09mm; HelpURL: \\cern.ch\dfs\Applications\Altium\Datasheets\AMPHENOL_302102.pdf; Author: CERN DEM MR; CreateDate: 28.11.2017; LatestRevisionDate: 19.12.2017
J9 J11 J13 J15 J40 J43 J45 J47 = SAMTEC_MMCX-J-P-H-ST-TH1: Part Description: Straight Through-hole 50 Ohm Micro Mini RF Jack, MMCX Series; Manufacturer: SAMTEC; PressFit: No; Part Number: SAMTEC_MMCX-J-P-H-ST-TH1; Component Kind: Standard; Component Type: Standard; Pin Count: 2; Mounted: Yes; Socket: No; SMD: No; Sense: No; Status: None; ComponentHeight: 4.35mm; HelpURL: \\cern.ch\dfs\Applications\Altium\Datasheets\SAMTEC_MMCX-J-P-H-ST-TH1.pdf; Author: CERN DEM JLC; CreateDate: 05.12.2012; LatestRevisionDate: 05.12.2012
J10#1 J12#1 J14#1 J16#1 J42 J44 J46 J48 = SAMTEC_SMPM-PF-P-HG-ST-EM-1: Part Description: SMPM-EM - 50 Ohm SMPM Plugs to 65 GHz, Full Detent Edge Mount; Manufacturer: SAMTEC; PressFit: No; Part Number: SAMTEC_SMPM-PF-P-HG-ST-EM-1; Component Kind: Accessories; Component Type: Standard; Pin Count: 5; Family: SMPM; Mounted: Yes; Socket: No; SMD: Yes; Sense: No; Status: None; Manufacturer Part Number: SMPM-PF-P-HG-ST-EM-1; ComponentHeight: 1.74mm; HelpURL: \\cern.ch\dfs\Applications\Altium\Datasheets\SAMTEC_SMPM-PF-P-HG-ST-EM-1.pdf; Author: CERN DEM HF; CreateDate: 04.08.2022; LatestRevisionDate: 04.08.2022
J37 J39 = HIROSE_U.FL-R-SMT-1(10): Part Description: Up to 6GHz Ultra Small Surface Mount Male Coaxial Connectors U.FL Series; Manufacturer: HIROSE (HRS); PressFit: No; Part Number: HIROSE_U.FL-R-SMT-1(10); Component Kind: Standard; Component Type: Standard; Pin Count: 2; Family: U.FL; Mounted: Yes; Socket: No; SMD: Yes; Sense: No; Status: None; Manufacturer Part Number: U.FL-R-SMT-1(10); ComponentHeight: 1.25mm; HelpURL: \\cern.ch\dfs\Applications\Altium\Datasheets\HIROSE_U.FL-R-SMT-1(10).pdf; Author: CERN DEM JLC; CreateDate: 24.03.2010; LatestRevisionDate: 24.03.2010
LD5 = LED_AVAGO_HSME-C120: LED Green 1C 2A; Part Description: High Performance Right Angle Chip Green LED; Manufacturer: AVAGO TECHNOLOGIES; PressFit: No; Bonding: No; Part Number: LED_AVAGO_HSME-C120; Component Kind: Standard; Component Type: Standard; Color: Green; PackageDescription: Green Chip LED, 2-Leads, Body 1.7x1.1mm, Side Emitting Package; Manufacturer Part Number: HSME-C120; Pin Count: 2; Mounted: Yes; Socket: No; SMD: Yes; Sense: No; ComponentHeight: 0.7mm; HelpURL: \\cern.ch\dfs\Applications\Altium\Datasheets\LED_AVAGO_HSME-C120.pdf; ComponentLink1URL: \\cern.ch\dfs\Applications\Altium\Datasheets\LED_AVAGO_HSME-C110_DESIGN-GUIDE.pdf; ComponentLink1Description: Design Guide; Author: CERN DEM JMW; CreateDate: 22.07.2009; LatestRevisionDate: 20.06.2012
P1 = 658855603040: WR-BTB Board to Board Connector, Male Plug, pitch 0.8mm, height 5.6mm, 40p; Manufacturer: Wurth Elektronik; Compliance: Lead free / RoHS; Contact Resistance: 50mΩ; Insulation Resistance: 100MΩ; Rated Current: 0.5A; Working Voltage: 50VAC; Withstanding Voltage: 500VAC; ComponentLink1Description: Website Link; ComponentLink1URL: https://www.we-online.com/redexpert/article/658855603040?ad; ComponentLink2Description: Datasheet Link; ComponentLink2URL: https://www.we-online.com/redexpert/spec/658855603040?ad; Manufacturer Part Number: 658855603040; Category: Board-to-Board Connectors; Match Code: WR-BTB; Mount: Surface Mount; Operating Temperature Max: 85°C; Operating Temperature Min: -55°C; Packaging: Tape and Reel; Height: 5.6mm; Gender: Male Plug; Number of Pins: 40; Orientation: Vertical; Pitch: 0.8mm
R3#1 = R0402_10K_1%_0.0625W_100PPM: Resistor - 1%; Part Description: General Purpose Thick Film Chip Resistor; Manufacturer: GENERIC; Manufacturer1 Part Number: 232270671003L; TC: ±100ppm/°C; PressFit: No; Tolerance: ±1%; Case: 0402; Value: 10k; Part Number: R0402_10K_1%_0.0625W_100PPM; Component Kind: Standard; Component Type: Standard; Pin Count: 2; Status: Not Recommended; Power: 0.0625W; Manufacturer Part Number: R0402_10K_1%_0.0625W_100PPM; Mounted: Yes; Sense: No; Socket: No; SMD: Yes; Manufacturer1 Example: YAGEO PHYCOMP; Manufacturer1 ComponentHeight: 0.4mm; HelpURL: \\cern.ch\dfs\Applications\Altium\Datasheets\R0402_Phycomp_RC0402.pdf; Author: CERN DEM JLC; CreateDate: 03.12.2007; LatestRevisionDate: 17.10.2012
R105 = R0402_NO-VALUE: Resistor; Part Description: Reserved Footprint For a 0402 (1005) Chip Resistor; PressFit: No; Mounted: No; Part Number: R0402_NO-VALUE; Component Kind: Standard; Component Type: Standard; Pin Count: 2; Value: Undefined; Status: None; Manufacturer: Undefined; Manufacturer Part Number: R0402_NO-VALUE; Case: 0402; Sense: No; Socket: No; SMD: Yes; Manufacturer1 Example: Undefined; Manufacturer1 Part Number: Undefined; Manufacturer1 ComponentHeight: Undefined; HelpURL: Undefined; Author: CERN DEM JLC; CreateDate: 03.12.2007; LatestRevisionDate: 13.03.2008
R106 = R0402_0R_JUMPER: Resistor; Part Description: 1A (0.05R Max DC Resistance) Zero Ohm Jumper; Manufacturer: GENERIC; Manufacturer1 Part Number: 232270591001L; PressFit: No; Part Number: R0402_0R_JUMPER; Component Kind: Standard; Component Type: Standard; Pin Count: 2; Value: 0; Status: Not Recommended; Manufacturer Part Number: R0402_0R_JUMPER; Case: 0402; Mounted: Yes; Sense: No; Socket: No; SMD: Yes; Manufacturer1 Example: YAGEO PHYCOMP; Manufacturer1 ComponentHeight: 0.4mm; HelpURL: \\cern.ch\dfs\Applications\Altium\Datasheets\R0402_Phycomp_RC0402.pdf; Author: CERN DEM JLC; CreateDate: 03.12.2007; LatestRevisionDate: 17.10.2012
R141 R142 R144 R154 = R0402_1K_1%_0.0625W_100PPM: Resistor - 1%; Part Description: General Purpose Thick Film Chip Resistor; Manufacturer: GENERIC; Manufacturer1 Part Number: 232270671002L; TC: ±100ppm/°C; PressFit: No; Part Number: R0402_1K_1%_0.0625W_100PPM; Component Kind: Standard; Component Type: Standard; Pin Count: 2; Value: 1k; Status: Not Recommended; Power: 0.0625W; Manufacturer Part Number: R0402_1K_1%_0.0625W_100PPM; Case: 0402; Mounted: Yes; Sense: No; Socket: No; SMD: Yes; Manufacturer1 Example: YAGEO PHYCOMP; Manufacturer1 ComponentHeight: 0.4mm; HelpURL: \\cern.ch\dfs\Applications\Altium\Datasheets\R0402_Phycomp_RC0402.pdf; Author: CERN DEM JLC; CreateDate: 03.12.2007; LatestRevisionDate: 17.10.2012
R215 = R0402_240R_1%_0.0625W_100PPM: Resistor - 1%; Part Description: General Purpose Thick Film Chip Resistor; Manufacturer: GENERIC; Manufacturer1 Part Number: 232270672401L; TC: ±100ppm/°C; PressFit: No; Part Number: R0402_240R_1%_0.0625W_100PPM; Component Kind: Standard; Component Type: Standard; Pin Count: 2; Value: 240; Status: Not Recommended; Power: 0.0625W; Tolerance: ±1%; Manufacturer Part Number: R0402_240R_1%_0.0625W_100PPM; Case: 0402; Mounted: Yes; Sense: No; Socket: No; SMD: Yes; Manufacturer1 Example: YAGEO PHYCOMP; Manufacturer1 ComponentHeight: 0.4mm; HelpURL: \\cern.ch\dfs\Applications\Altium\Datasheets\R0402_Phycomp_RC0402.pdf; Author: CERN DEM JLC; CreateDate: 03.12.2007; LatestRevisionDate: 17.10.2012
T5 = BSH103: N-CHANNEL MOSFET WITH DIODE; Part Description: 30V 850mA N-Channel Enhancement Mode Field-Effect Transistor; Manufacturer: NEXPERIA; PressFit: No; Bonding: No; Part Number: BSH103; Component Kind: Standard; Component Type: Standard; Device: BSH103; PackageDescription: SOT23, 3 pin, Pitch 0.95mm - 1.3mm W X 2.9mm L X 1.1mm H, IPC Medium Density; Manufacturer Part Number: BSH103; Pin Count: 3; Case: SOT23-3; Mounted: Yes; Socket: No; SMD: Yes; Sense: No; ComponentHeight: 1.1mm; HelpURL: \\cern.ch\dfs\Applications\Altium\Datasheets\BSH103.pdf; Author: CERN DEM JLC; CreateDate: 16.03.2010; LatestRevisionDate: 20.06.2017

## Sheet AWG_CLK_Connectors.SchDoc: RFSOC_SAWG
size 420 x 297 mm; Author: G.Kasprowicz; CompanyName: WUT ISE; DrawnBy: G.Kasprowicz; Organization: WUT ISE; Address1: PW ISE; Address2: Nowowiejska 15/19 00-665 Warsaw; Address3: gkasprow@gmail.com; DocumentNumber: 3; Revision: 1; SheetNumber: 3; SheetTotal: 20; ModifiedBy: -; CheckedDate: -; Title2: AWG CLK Connectors; DivGrp: WUT ISE; Designer: G.Kasprowicz; ModifiedDate: -; ProjectName: Sensor Box
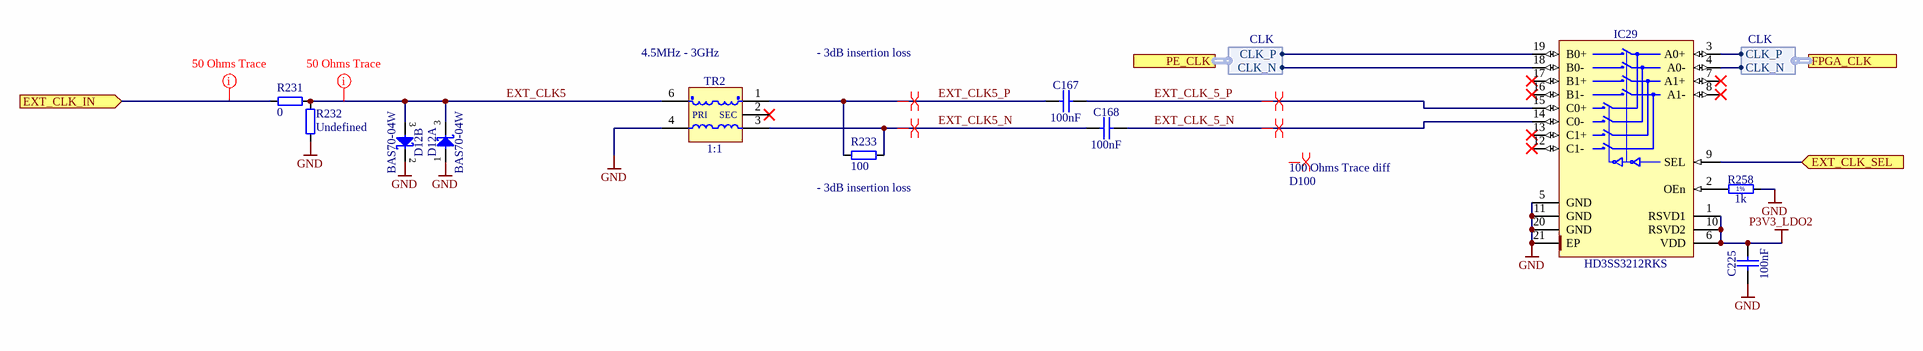
[diagram p1: AWG_CLK_Connectors.SchDoc]

### Parts
C167  100nF  [CAPC0603X33N]
C168  100nF  [CAPC0603X33N]
C225  100nF  [CAPC1005X55N]
D12  BAS70-04W  [SOT65P210X110-3N]  (parts A,B of 2)
IC29  HD3SS3212RKS  [TEXAS_RKS0020A]
R231  0  [RESC1005X40N]
R232  Undefined  [RESC1005X40N]
R233  100  [RESC1005X35N]
R258  1k  [RESC1005X40N]
TR2  1:1  [XFMR_MINI-CIRCUITS_AT224]

### Ports
EXT_CLK_IN (in), EXT_CLK_SEL (in), FPGA_CLK (harness CLK), PE_CLK (harness CLK)

### Harnesses
CLK: CLK_P, CLK_N

### Nets
GND: C225.1 D12.1(A) D12.2(C) IC29.5(GND) IC29.11(GND) IC29.20(GND) IC29.21(EP) R232.2 R258.2 TR2.4(P)
P3V3_LDO2: C225.2 IC29.1(RSVD1) IC29.6(VDD) IC29.10(RSVD2)
CLK2_N: IC29.4(A0-) ; port FPGA_CLK.CLK_N
CLK2_P: IC29.3(A0+) ; port FPGA_CLK.CLK_P
EXT_CLK5: D12.3(COMAC) R231.2 R232.1 TR2.6(PDOT)
EXT_CLK5_N: C168.1 R233.2 TR2.3(S)
EXT_CLK5_P: C167.1 R233.1 TR2.1(SDOT)
EXT_CLK_5_N: C168.2 IC29.14(C0-)
EXT_CLK_5_P: C167.2 IC29.15(C0+)
EXT_CLK_SEL: IC29.9(SEL) ; port EXT_CLK_SEL
PE_CLK.CLK_N: IC29.18(B0-) ; port PE_CLK.CLK_N
PE_CLK.CLK_P: IC29.19(B0+) ; port PE_CLK.CLK_P
NetIC29_2: IC29.2(OEn) R258.1
NetJ7_1: R231.1 ; port EXT_CLK_IN

Not connected (* = marked no-connect by the designer): IC29 7(A1+)* 8(A1-)* 12(C1-)* 13(C1+)* 16(B1-)* 17(B1+)*; TR2 2(NC)*

### Layout directives
differential pair; differential pair class 100 Ohms Trace diff; net class D100: (no net found under the mark)
net class 50 Ohms Trace: EXT_CLK5, NetJ7_1
differential pair: EXT_CLK5_N, EXT_CLK5_P, EXT_CLK_5_N, EXT_CLK_5_P

### Notes on the sheet
- (near TR2) 4.5MHz - 3GHz
- - 3dB insertion loss
- (near R233) - 3dB insertion loss
- Project/Equipment
- Document
- Designer
- Drawn by
- Check.by
- Copyright WUT ISE 2020.
  This documentation describes Open Hardware and is licensed under the CERN OHL v.1.2. You may redistribute and modify this documentation under the terms of the CERN OHL v.1.2. (http://ohwr.org/CERNOHL). This documentation is distributed WITHOUT ANY EXPRESS OR IMPLIED WARRANTY, INCLUDING OF MERCHANTABILITY, SATISFACTORY QUALITY AND FITNESS FOR A PARTICULAR PURPOSE. Please see the CERN OHL v.1.2 for applicable conditions.
- Contact
- File
- Last Mod.
- Print Date
- Sheet
- Size
- A3
- of
- Rev
- (in symbol R0402_1K_1%_0.0625W_100PPM) 1%
- (in symbol XFMR_MINI-CIRCUITS_TC1-1-13M+) PRI; SEC

### Library data of the parts
C167 C168 = CC0201_100NF_6.3V_10%_X5R: Non-polarised capacitor; Part Description: SMD Multilayer Chip Ceramic Capacitor; Manufacturer: GENERIC; Manufacturer1 Part Number: 02016D104KAT2A; Voltage: 6.3V; TC: X5R; Tolerance: ±10%; Part Number: CC0201_100NF_6.3V_10%_X5R; Component Kind: Standard; Component Type: Standard; Pin Count: 2; Value: 100nF; Status: Not Recommended; Manufacturer Part Number: CC0201_100NF_6.3V_10%_X5R; Case: 0201; Mounted: Yes; Socket: No; SMD: Yes; Sense: No; Manufacturer1 Example: AVX; Manufacturer1 ComponentHeight: 0.33mm; HelpURL: \\cern.ch\dfs\Applications\Altium\Datasheets\CC0201_X5R_AVX.pdf; Author: CERN DEM JLC; CreateDate: 03.12.2007; LatestRevisionDate: 03.12.2007
C225 = CC0402_100NF_16V_10%_X7R: Non-polarised capacitor; Part Description: SMD Multilayer Chip Ceramic Capacitor; Manufacturer: GENERIC; Manufacturer1 Part Number: GRM155R71C104KA88D; Voltage: 16V; TC: X7R; Tolerance: ±10%; Part Number: CC0402_100NF_16V_10%_X7R; Component Kind: Standard; Component Type: Standard; Pin Count: 2; Value: 100nF; Status: Not Recommended; Manufacturer Part Number: CC0402_100NF_16V_10%_X7R; Case: 0402; Mounted: Yes; Socket: No; SMD: Yes; Sense: No; Manufacturer1 Example: MURATA; Manufacturer1 ComponentHeight: 0.55mm; HelpURL: \\cern.ch\dfs\Applications\Altium\Datasheets\CC0402_X7R_MURATA_GRM.pdf; Author: CERN DEM JLC; CreateDate: 05/12/2013; LatestRevisionDate: 03/12/2007
D12 = BAS70-04W: Serial Schottky Diode; Part Description: Dual Series General-Purpose Schottky Diodes; Manufacturer: NXP SEMICONDUCTORS; Voltage: 70V; Power: 70mA; PressFit: No; Bonding: No; Part Number: BAS70-04W; Component Kind: Standard; Component Type: Standard; Device: BAS70-04W; PackageDescription: SOT323, 0.65mm Pitch; 3 Pin, 1.25mm W X 2.00mm L X 1.10mm H body, IPC Medium Density; Manufacturer Part Number: BAS70-04W; Pin Count: 3; Case: SOT323; Mounted: Yes; Socket: No; SMD: Yes; Sense: No; ComponentHeight: 1.10mm; HelpURL: \\cern.ch\dfs\Applications\Altium\Datasheets\BAS70-04W.pdf; Author: CERN DEM JLC; CreateDate: 05.12.2013; LatestRevisionDate: 05.12.2013
IC29 = HD3SS3212RKS: Two-Channel Differential 2:1/1:2 USB3.1 Mux/Demux; Manufacturer: TEXAS INSTRUMENTS; PressFit: No; Bonding: No; Part Number: HD3SS3212RKS; Component Kind: Standard; Component Type: Standard; Device: HD3SS3212RKS; PackageDescription: QFN, TEXAS Case Style RKS, 0.50mm Pitch, Rect.; 20 Pin, 2.50mm L X 4.50mm W X 1.00mm H body (w/Thermal Tab 1.1mm X 3.1mm); Part Description: Two-Channel Differential 2:1/1:2 USB3.1 Mux/Demux; Manufacturer Part Number: HD3SS3212RKS; Pin Count: 21; Case: TQFN20; Mounted: Yes; Socket: No; SMD: Yes; Sense: No; ComponentHeight: 1mm; Author: CERN DEM BC; HelpURL: \\cern.ch\dfs\Applications\Altium\Datasheets\HD3SS3212RKS.pdf; CreateDate: 2019-11-06; LatestRevisionDate: 2019-11-06
R231 = R0402_0R_JUMPER: as R106 on sheet RFSOC_SAWG; Case: 0402; Value: 0; Part Number: R0402_0R_JUMPER; Component Kind: Standard; Component Type: Standard; Pin Count: 2; Status: Not Recommended; Manufacturer Part Number: R0402_0R_JUMPER; Mounted: Yes; Sense: No; Socket: No; SMD: Yes; Manufacturer1 Example: YAGEO PHYCOMP; Manufacturer1 ComponentHeight: 0.4mm; HelpURL: \\cern.ch\dfs\Applications\Altium\Datasheets\R0402_Phycomp_RC0402.pdf; Author: CERN DEM JLC; CreateDate: 03.12.2007; LatestRevisionDate: 17.10.2012
R232 = R0402_NO-VALUE: as R105 on sheet RFSOC_SAWG; Case: 0402; Value: Undefined; Part Number: R0402_NO-VALUE; Component Kind: Standard; Component Type: Standard; Pin Count: 2; Status: None; Manufacturer: Undefined; Manufacturer Part Number: R0402_NO-VALUE; Sense: No; Socket: No; SMD: Yes; Manufacturer1 Example: Undefined; Manufacturer1 Part Number: Undefined; Manufacturer1 ComponentHeight: Undefined; HelpURL: Undefined; Author: CERN DEM JLC; CreateDate: 03.12.2007; LatestRevisionDate: 13.03.2008
R233 = R0402_100R_0.1%_0.063W_25PPM: Resistor - 0.1%; Part Description: Thin Film Precision Resistor; Manufacturer: GENERIC; Manufacturer1 Part Number: CPF0402B100RE1; Power: 0.063W; TC: ±25ppm/°C; PressFit: No; Case: 0402; Value: 100; Tolerance: ±0.1%; Part Number: R0402_100R_0.1%_0.063W_25PPM; Component Kind: Standard; Component Type: Standard; Pin Count: 2; Status: Not Recommended; Manufacturer Part Number: R0402_100R_0.1%_0.063W_25PPM; Mounted: Yes; Sense: No; Socket: No; SMD: Yes; Manufacturer1 Example: TE CONNECTIVITY; Manufacturer1 ComponentHeight: 0.35mm; HelpURL: \\cern.ch\dfs\Applications\Altium\Datasheets\R0402_TYCO_CPF.pdf; Author: CERN DEM JMW; CreateDate: 22.09.2015; LatestRevisionDate: 22.09.2015
R258 = R0402_1K_1%_0.0625W_100PPM: as R141 on sheet RFSOC_SAWG; Part Number: R0402_1K_1%_0.0625W_100PPM; Component Kind: Standard; Component Type: Standard; Pin Count: 2; Value: 1k; Status: Not Recommended; Power: 0.0625W; Tolerance: ±1%; Manufacturer Part Number: R0402_1K_1%_0.0625W_100PPM; Case: 0402; Mounted: Yes; Sense: No; Socket: No; SMD: Yes; Manufacturer1 Example: YAGEO PHYCOMP; Manufacturer1 ComponentHeight: 0.4mm; HelpURL: \\cern.ch\dfs\Applications\Altium\Datasheets\R0402_Phycomp_RC0402.pdf; Author: CERN DEM JLC; CreateDate: 2007-12-03; LatestRevisionDate: 2012-10-17
TR2 = XFMR_MINI-CIRCUITS_TC1-1-13M+: 50 Ohms 4.5 To 3000MHz RF Transformers; Part Number: XFMR_MINI-CIRCUITS_TC1-1-13M+; Component Kind: Standard; Component Type: Standard; Pin Count: 5; Value: 1:1; Status: None; Part Description: 50 Ohms 4.5 to 3000MHz RF Transformer; Manufacturer: MINI-CIRCUITS; Manufacturer Part Number: TC1-1-13M+; Mounted: Yes; Socket: No; Sense: No; SMD: Yes; ComponentHeight: 3.81mm; HelpURL: \\cern.ch\dfs\Applications\Altium\Datasheets\XFMR_MINI-CIRCUITS_TC1-1-13M+.pdf; Author: CERN DEM JLC; CreateDate: 30.11.2011; LatestRevisionDate: 30.11.2011